# EasyEDA Pro project 包裹款-触摸屏控制板V1.eprj, board PCB
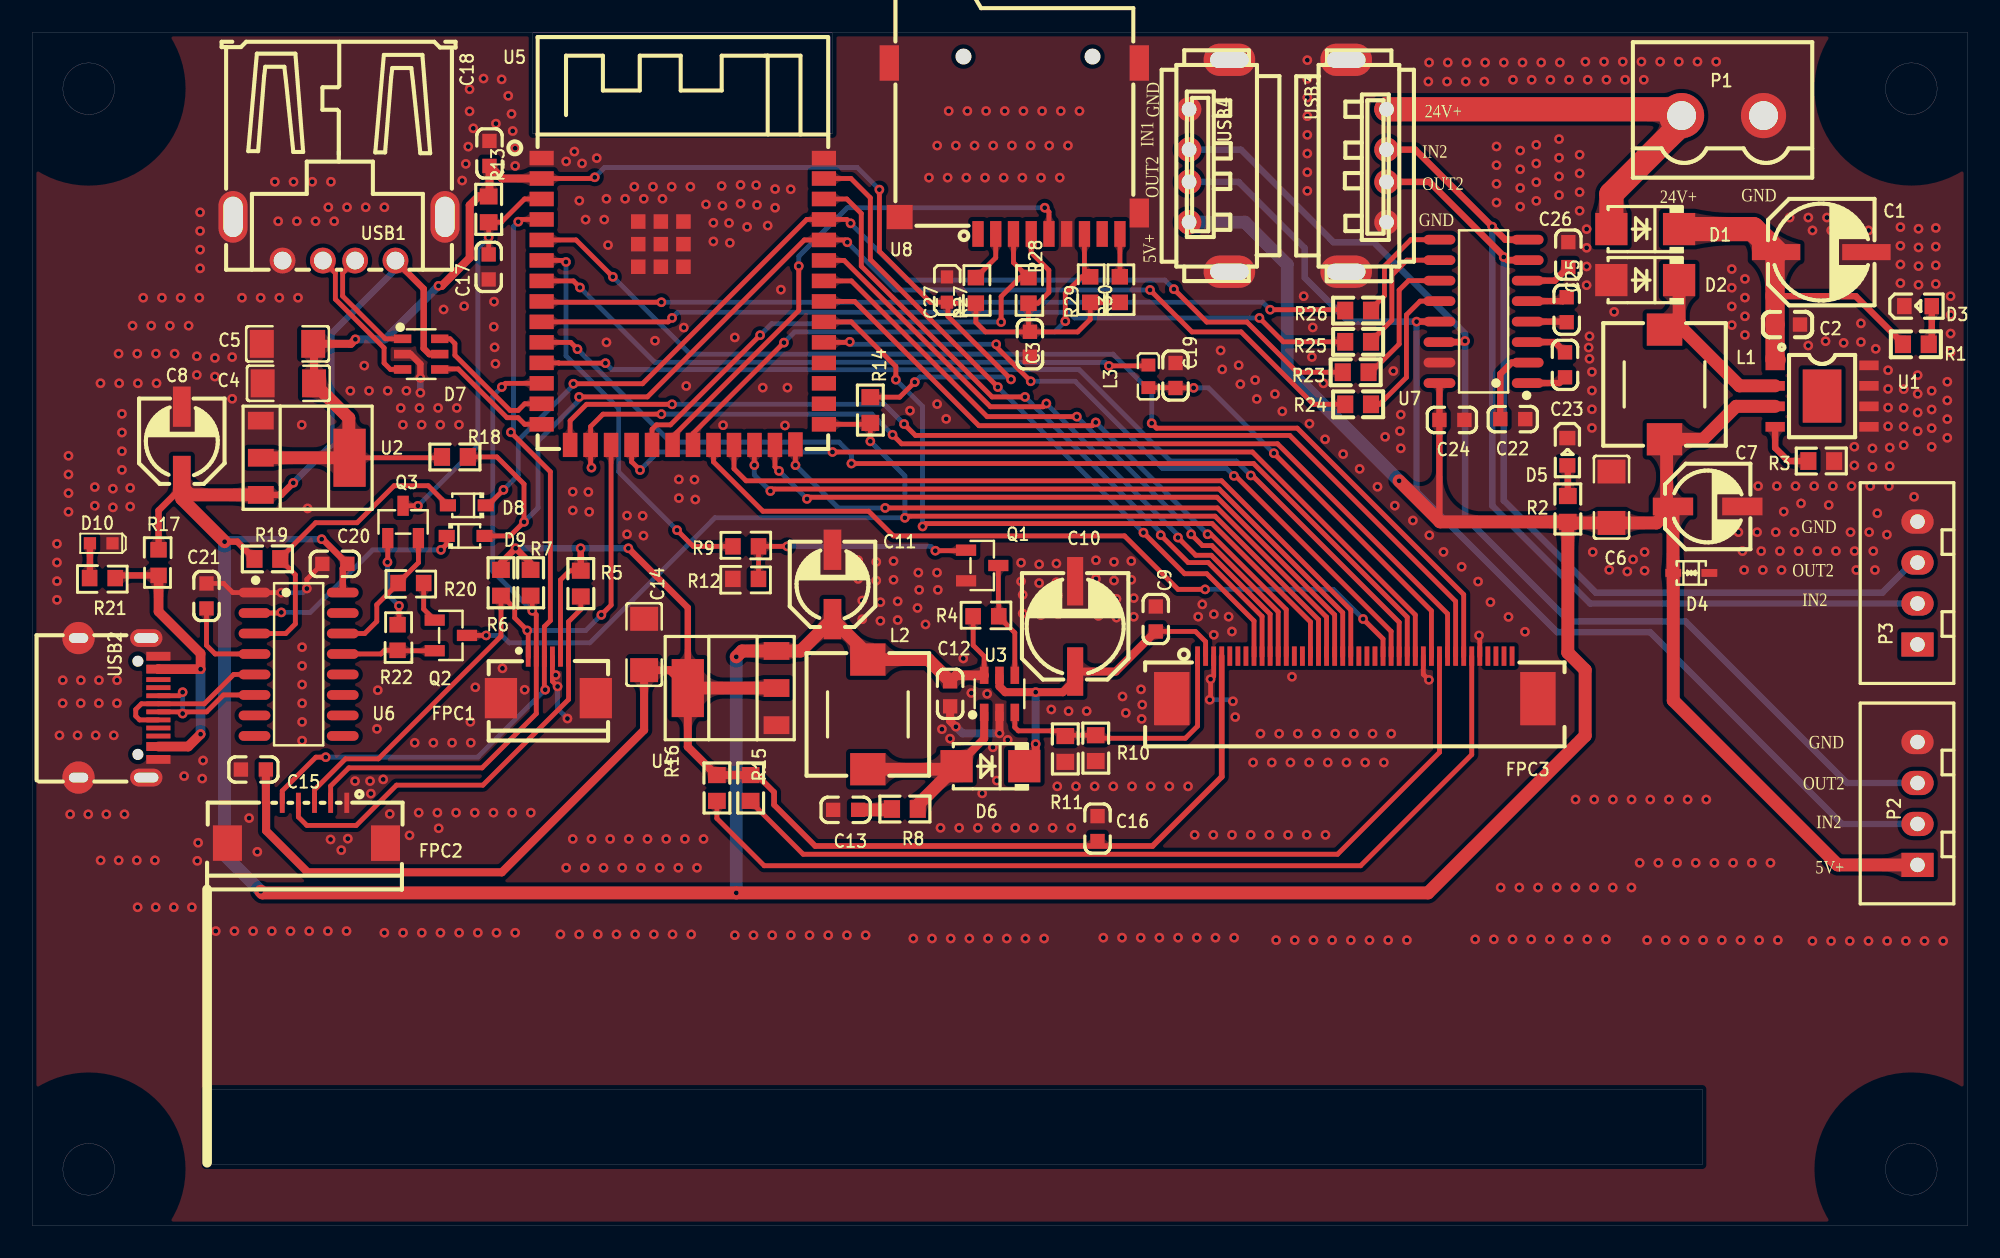
[diagram p1: board, top side]
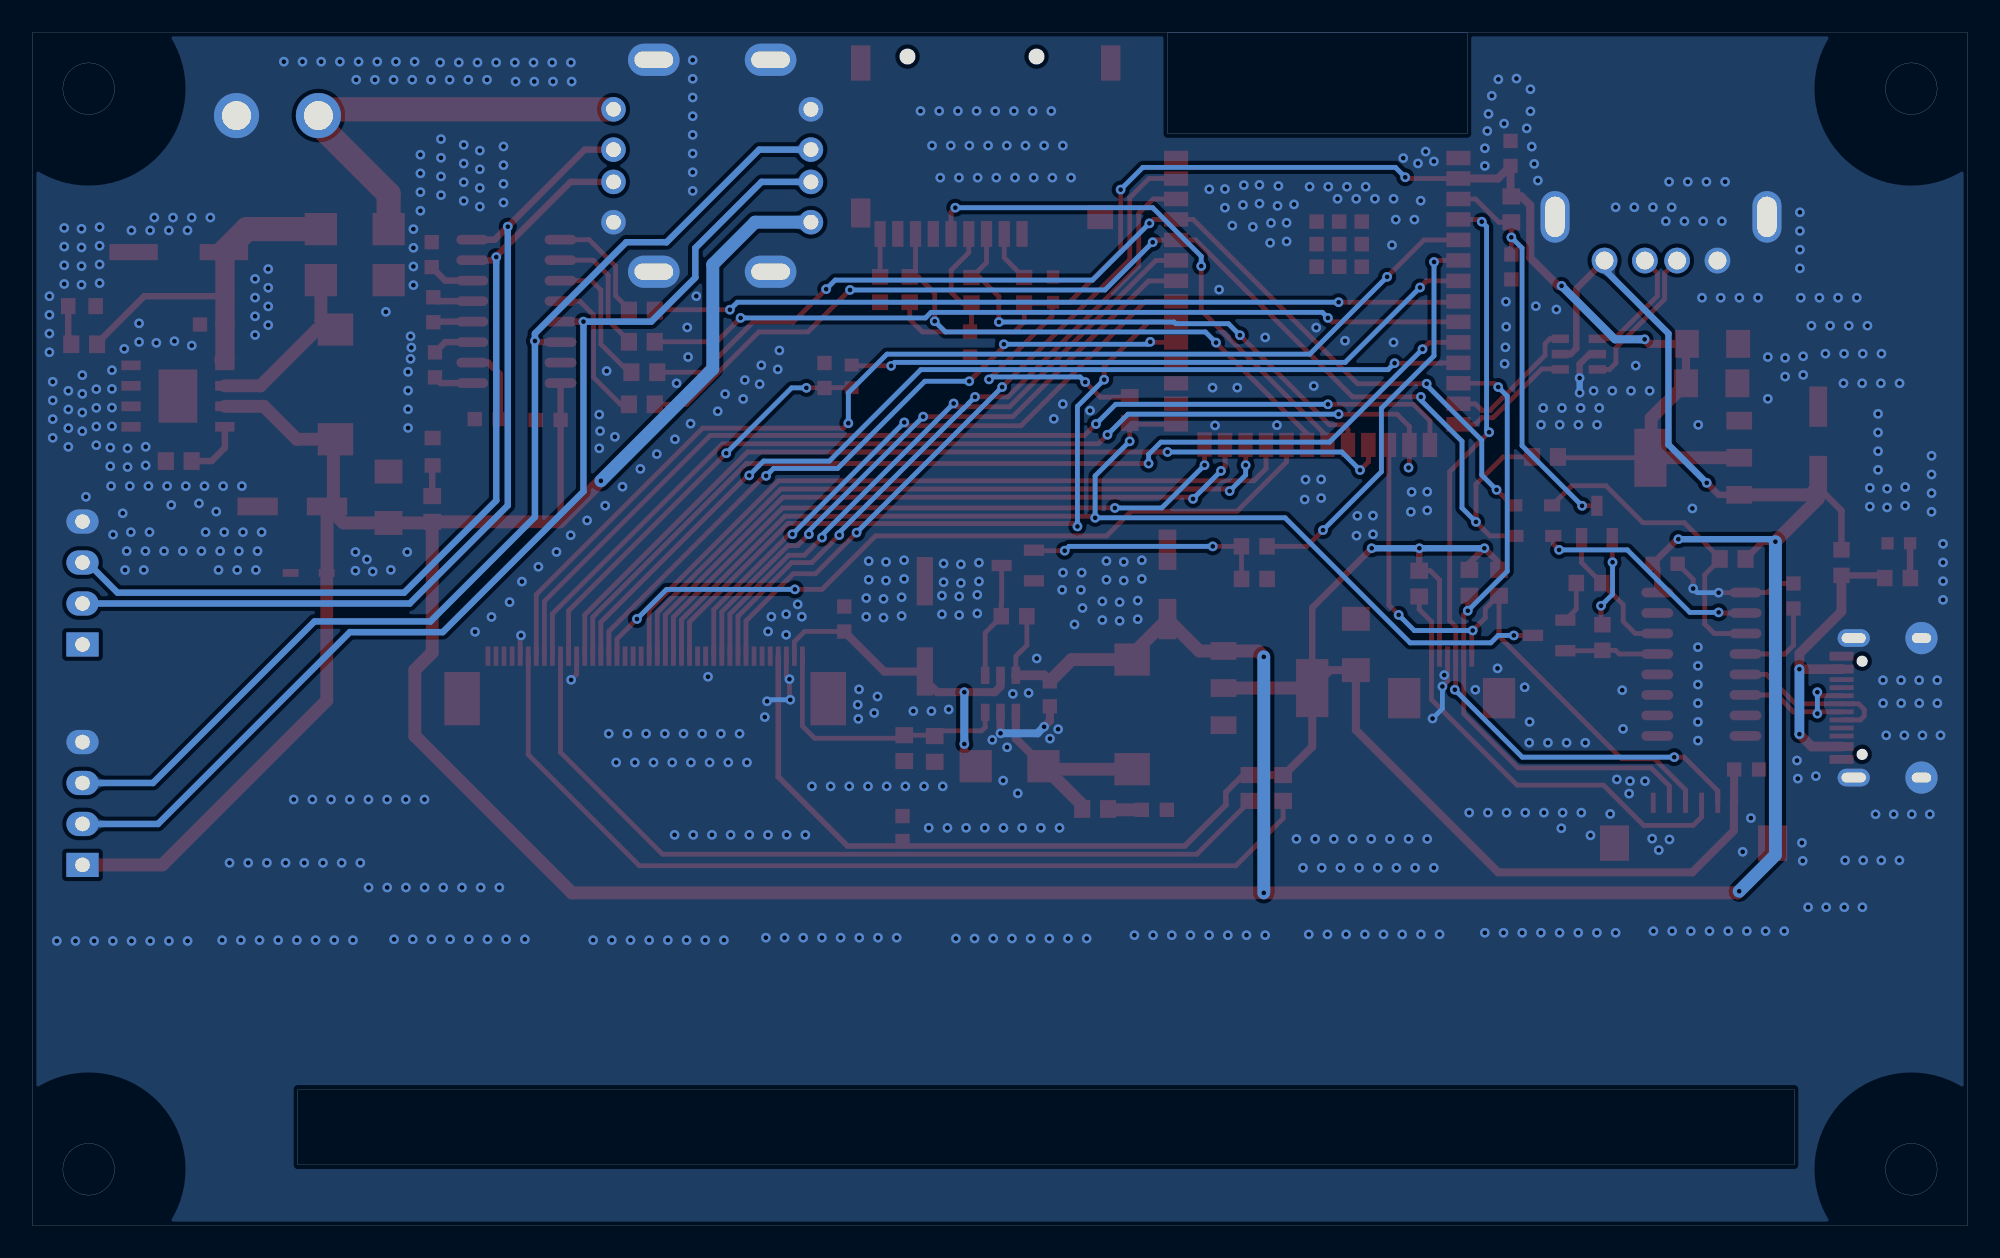
[diagram p2: board, bottom side, seen from below]

Outline 120 x 74 mm; copper layers: Top Layer, Bottom Layer. Coordinates in mm from the lower left corner of the outline.
Outline path: rectangle 0,74 120,0 ; circle c3.5,70.5 r1.6 ; circle c3.5,3.5 r1.6 ; rectangle 10.76,8.47 103.53,3.77 ; rectangle 31.04,73.98 49.6,67.71 ; circle c116.5,70.5 r1.6 ; circle c116.5,3.5 r1.6
Stack: Top Layer 0.035mm / Dielectric1 1.51mm FR4 er 4.5 / Bottom Layer 0.035mm

## Design rules (mm)
net USB_D+: DP1
net USB_D-: DP1
net D1-: DP2
net D1+: DP2
template: 用户自定义配置
spacing Default (default): track to track 0.152, other pairs 0 to 0.152
track width Default (default): min 0.254, default 0.254, max 25.4
differential pair differentialPair (default): width min 0.127, default 0.254, max 2.54; gap min 0.152, default 0.152
via Default (default): diameter min 0.25, default 0.61, max 100.025; hole min 0.2, default 0.305, max 59.995

## Placement (name value [footprint] x y rotation side)
C1  100uF/35V  [电解电容贴片6X6]  110.92 60.37 0 top
C2  104  [0603C]  108.83 55.88 180 top
C3  104  [0603C]  61.85 54.66 90 top
C4  4.7uF  [C1206]  15.88 52.23 0 top
C5  4.7uF  [C1206]  15.83 54.68 0 top
C6  10uF  [C1206]  97.91 45.17 90 top
C7  100uF/10V  [CAP-SMD_BD5.0-L5.3-W5.3-RD]  103.87 44.6 180 top
C8  100uF/10V  [CAP-SMD_BD5.0-L5.3-W5.3-RD]  9.27 48.64 270 top
C9  104  [0603C]  69.66 37.62 270 top
C10  100uF/35V  [电解电容贴片6X6]  64.66 37.16 90 top
C11  100uF/10V  [CAP-SMD_BD5.0-L5.3-W5.3-RD]  49.61 39.76 270 top
C12  104  [0603C]  56.91 32.98 90 top
C13  10pF  [0603C]  50.43 25.79 0 top
C14  4.7uF  [C1206]  37.94 36.04 270 top
C15  104  [0603C]  13.71 28.29 0 top
C16  104  [0603C]  66.05 24.63 270 top
C17  104  [0603C]  28.3 59.45 90 top
C18  104  [0603C]  28.35 66.49 270 top
C19  10pF  [0603C]  70.88 52.72 270 top
C20  104  [0603C]  18.76 41.04 180 top
C21  104  [0603C]  10.8 39.05 90 top
C22  104  [0603C]  91.79 50.01 180 top
C23  104  [0603C]  95.03 53.38 270 top
C24  104  [0603C]  88.02 49.96 180 top
C25  104  [0603C]  95.13 56.8 270 top
C26  104  [0603C]  95.23 60.21 90 top
C27  104  [11]  57.01 58.79 90 top
D1  SS56  [SMA]  100 61.8 180 top
D2  SS56  [SMA]  100 58.63 180 top
D3  绿光  [0603LED]  116.88 57 180 top
D4  PESD5V0L1BA-N  [SOD-323_L1.8-W1.3-LS2.5-BI]  102.86 40.48 180 top
D5  绿光  [0603LED]  95.16 48.03 90 top
D6  SS56  [SMA]  59.41 28.49 180 top
D7  USBLC6-2SC6  [SOT-23-6_L2.9-W1.6-P0.95-LS2.8-BL]  24.11 54.04 270 top
D8  1N4148WS  [SOD-323_L1.8-W1.3-LS2.5-RD]  26.94 44.67 180 top
D9  1N4148WS  [SOD-323_L1.8-W1.3-LS2.5-RD]  26.87 42.77 0 top
D10  LED红  [0603L]  4.27 42.31 0 top
FPC1  FPC-05F-6PH20(0.5)  [FPC-SMD_6P-P0.50_XUNPU_FPC-05F-6PH20]  32 34 0 top
FPC2  AFA01-S06FCC(1.0)  [FPC-SMD_6P-P1.00_AFA01-S06]  17 24.97 0 top
FPC3  AFC07-S40ECA-00  [FPC-SMD_P0.50-40P_LCS-SJ-H2.0]  82 34 180 top
L1  68uH  [IND-SMD_L7.0-W7.0_SMDRI74-330MT]  101.2 52.16 90 top
L2  10uH  [IND-SMD_L7.0-W7.0_SMDRI74-330MT]  51.81 31.71 270 top
L3  10uH  [L0603]  69.2 52.67 90 top
P1  KF2EDGVC-5.08-2P  [CONN-TH_P5.08_KF2EDGVC-5.08-2P]  104.8 68.83 180 top
P2  4P  [HDR1X4_CON]  116.88 22.37 90 top
P3  4P  [HDR1X4_CON]  116.88 36.04 90 top
Q1  SS8050  [SOT-23-3_L2.9-W1.3-P1.90-LS2.4-BR]  58.9 40.94 180 top
Q2  SS8050  [SOT-23-3_L2.9-W1.3-P1.90-LS2.4-BR]  25.95 36.6 180 top
Q3  SS8050  [SOT-23-3_L2.9-W1.3-P1.90-LS2.4-BR]  22.99 43.64 270 top
R1  47K  [0603R]  116.78 54.66 180 top
R2  10K  [0603R]  95.2 44.44 270 top
R3  10K  [0603R]  110.92 47.41 0 top
R4  10K  [10]  58.23 37.67 0 top
R5  10K  [0603R]  34.01 39.81 270 top
R6  10K  [0603R]  29.06 39.87 270 top
R7  10K  [0603R]  30.9 39.87 270 top
R8  10K  [0603R]  54.1 25.84 180 top
R9  1K  [10]  43.34 42.01 0 top
R10  10K  [0603R]  65.93 29.61 270 top
R11  10K  [0603R]  64.05 29.56 270 top
R12  10K  [10]  45.13 40.22 180 top
R13  10K  [0603R]  28.3 63.02 270 top
R14  10K  [0603R]  51.96 50.58 270 top
R15  10K  [0603R]  44.54 27.14 270 top
R16  10K  [0603R]  42.45 27.14 270 top
R17  0Ω  [10]  7.95 40.22 90 top
R18  10K  [0603R]  26.2 47.67 180 top
R19  10K  [0603R]  14.58 41.34 0 top
R20  10K  [10]  24.37 39.97 180 top
R21  10K  [10]  5.24 40.27 180 top
R22  10K  [10]  22.53 37.37 270 top
R23  100Ω  [0603R]  82.2 50.93 180 top
R24  100Ω  [0603R]  82.05 52.92 180 top
R25  100Ω  [0603R]  82.2 54.81 180 top
R26  100Ω  [0603R]  82.2 56.75 180 top
R27  10K  [10]  58.39 58.89 270 top
R28  10K  [10]  61.65 58.89 270 top
R29  10K  [10]  65.48 58.94 270 top
R30  10K  [10]  67.31 58.94 270 top
U1  XL1509-5.0E1//SXL1509-5.0E1  [ESOP-8_L4.9-W3.9-P1.27-LS6.0-BL-EP]  110.97 51.44 270 top
U2  1117-3.3  [SOT-223]  16.87 47.62 270 top
U3  RY3730  [SOT-23-6_L2.9-W1.6-P0.95-LS2.8-BL_3]  59.97 32.98 0 top
U4  1117-3.3  [SOT-223]  43.44 33.34 90 top
U5  ESPS3-32-WROOM-1-N16R8  [WIRELM-SMD_ESP32-S3-WROOM-2-N32R8V]  40.33 57.31 0 top
U6  CH340C  [SOIC-16_L9.9-W3.9-P1.27-LS6.0-BL]  16.51 34.82 270 top
U7  SP3232EEN-L/TR  [SOIC-16_L9.9-W3.9-P1.27-LS6.0-BL]  89.98 56.69 90 top
U8  自弹TF卡座TFAA  [SIM-SMD_C9900015645]  60.89 66.79 180 top
USB1  U-USBAR04P-F002  [USB-A-TH_USB-302-T]  19.02 61.2 180 top
USB2  TYPE-C 16PIN  [USB-C-SMD_TYPE-C-6PIN+]  5.24 32.11 270 top
USB3  U-USBAS04P-F001  [USB-A-TH_USB-M-22]  82.71 65.72 270 top
USB4  U-USBAS04P-F001  [USB-A-TH_USB-M-22]  72.97 65.72 90 top

## Footprints (pads in the part's own frame, mm; a bottom-side part is the same pattern mirrored in y, then rotated)
10
  rect 0.965x1.016 smd: 1(0.101,0.117) 2(1.688,0.117)
11
  rect 0.813x0.762 smd: 1(0.043,0.296) 2(-1.524,0.301)
0603C
  rect 0.889x0.889 smd: 1(-0.774,0) 2(0.774,0)
0603L
  rect 0.762x0.762 smd: 1(-0.699,0) 2(0.699,0)
0603LED
  rect 0.9x1 smd: 1(-0.884,-0.017) 2(0.816,-0.017)
0603R
  rect 1x1.1 smd: 1(-0.8,0) 2(0.8,0)
C1206
  rect 1.485x1.728 smd: 1(-1.593,0) 2(1.593,0)
CAP-SMD_BD5.0-L5.3-W5.3-RD
  rect 2.5x1.1 smd: 1(2.15,0) 2(-2.15,0)
CONN-TH_P5.08_KF2EDGVC-5.08-2P
  round 2.8 hole 1.8: 1(-2.54,0) 2(2.54,0)
ESOP-8_L4.9-W3.9-P1.27-LS6.0-BL-EP
  rect 0.6x1.2 smd: 1(-1.905,-2.909) 2(-0.635,-2.909) 3(0.635,-2.909) 4(1.905,-2.909) 5(1.905,2.909) 6(0.635,2.909) 7(-0.635,2.909) 8(-1.905,2.909)
  rect 3.3x2.4 smd: 9(0,0)
FPC-SMD_6P-P0.50_XUNPU_FPC-05F-6PH20
  rect 0.3x1.25 smd: 1(-1.25,1.288) 2(-0.75,1.288) 3(-0.25,1.288) 4(0.25,1.288) 5(0.75,1.288) 6(1.25,1.288)
  rect 2x2.5 smd: 7(2.94,-1.288) 8(-2.94,-1.288)
FPC-SMD_6P-P1.00_AFA01-S06
  rect 0.3x1.25 smd: 1(2.5,1.25) 2(1.5,1.25) 3(0.5,1.25) 4(-0.5,1.25) 5(-1.5,1.25) 6(-2.5,1.25)
  rect 1.8x2.2 smd: 7(4.9,-1.25) 8(-4.9,-1.248)
FPC-SMD_P0.50-40P_LCS-SJ-H2.0
  rect 0.3x1.2 smd: 1(9.751,-1.318) 2(9.252,-1.318) 3(8.753,-1.318) 4(8.252,-1.318) 5(7.752,-1.318) 6(7.252,-1.318) 7(6.752,-1.318) 8(6.251,-1.318) 9(5.753,-1.318) 10(5.253,-1.318) 11(4.753,-1.318) 12(4.252,-1.318) 13(3.752,-1.318) 14(3.251,-1.318) 15(2.752,-1.318) 16(2.253,-1.318) 17(1.752,-1.318) 18(1.252,-1.318) 19(0.752,-1.318) 20(0.252,-1.318) 21(-0.249,-1.318) 22(-0.748,-1.318) 23(-1.247,-1.318) 24(-1.748,-1.318) 25(-2.248,-1.318) 26(-2.748,-1.318) 27(-3.248,-1.318) 28(-3.749,-1.318) 29(-4.247,-1.318) 30(-4.747,-1.318) 31(-5.247,-1.318) 32(-5.748,-1.318) 33(-6.248,-1.318) 34(-6.749,-1.318) 35(-7.248,-1.318) 36(-7.747,-1.318) 37(-8.248,-1.318) 38(-8.748,-1.318) 39(-9.248,-1.318) 40(-9.748,-1.318)
  rect 2.2x3.3 smd: 41(11.35,1.318) 42(-11.35,1.318)
HDR1X4_CON
  rect 1.5x2 hole 0.9: 1(0,0)
  oval 1.5x2 hole 0.9: 2(2.54,0) 3(5.08,0) 4(7.62,0)
IND-SMD_L7.0-W7.0_SMDRI74-330MT
  rect 2x2.2 smd: 1(-3.4,0) 2(3.4,0)
L0603
  rect 0.8x0.864 smd: 1(-0.7,0) 2(0.7,0)
SIM-SMD_C9900015645
  rect 0.7x1.6 smd: 1(2.25,5.3) 2(1.15,5.3) 3(0.05,5.3) 4(-1.05,5.3) 5(-2.15,5.3) 6(-3.25,5.3) 7(-4.35,5.3) 8(-5.45,5.3) 9(-6.55,5.3)
  rect 1.2x1.8 smd: 10(-7.75,4)
  rect 1.6x1.5 smd: 11(7.1,4.25)
  rect 1.2x2.2 smd: 12(-7.75,-5.3) 13(7.75,-5.3)
SMA
  rect 2x2 smd: 1(2.1,0) 2(-2.1,0)
SOD-323_L1.8-W1.3-LS2.5-BI
  rect 0.986x0.49 smd: 1(-1.117,0) 2(1.117,0)
SOD-323_L1.8-W1.3-LS2.5-RD
  rect 1x0.75 smd: 1(-1.173,0) 2(1.173,0)
SOIC-16_L9.9-W3.9-P1.27-LS6.0-BL
  oval 0.602x1.971 smd: 1(-4.445,-2.736) 2(-3.175,-2.736) 3(-1.905,-2.736) 4(-0.635,-2.736) 5(0.635,-2.736) 6(1.905,-2.736) 7(3.175,-2.736) 8(4.445,-2.736) 9(4.445,2.736) 10(3.175,2.736) 11(1.905,2.736) 12(0.635,2.736) 13(-0.635,2.736) 14(-1.905,2.736) 15(-3.175,2.736) 16(-4.445,2.736)
SOT-23-3_L2.9-W1.3-P1.90-LS2.4-BR
  rect 1.25x0.7 smd: 1(1,-0.95) 2(1,0.95) 3(-1,0)
SOT-23-6_L2.9-W1.6-P0.95-LS2.8-BL
  rect 0.532x1.072 smd: 1(-0.95,-1.149) 2(0,-1.149) 3(0.95,-1.149) 4(0.95,1.149) 5(0,1.149) 6(-0.95,1.149)
SOT-23-6_L2.9-W1.6-P0.95-LS2.8-BL_3
  rect 0.532x1.072 smd: 1(-0.95,-1.149) 2(0,-1.149) 3(0.95,-1.149) 4(0.95,1.149) 5(0,1.149) 6(-0.95,1.149)
SOT-223
  rect 1.1x1.6 smd: 1(-2.3,-2.7) 2(0,-2.7) 3(2.3,-2.7)
  rect 3.6x2 smd: 4(0,2.8)
USB-A-TH_USB-302-T
  round 1.6 hole 1.1: 1(-3.5,1.355) 2(-1,1.355) 3(1,1.355) 4(3.5,1.355)
  oval 1.8x3.2 hole 1.2x2.5: 5(-6.57,-1.355) 6(6.57,-1.355)
USB-A-TH_USB-M-22
  oval 2x3.2 hole 1x2.4: 0(-6.57,-1.25) 0(6.57,-1.25)
  round 1.524 hole 0.914: 1(-3.5,1.25) 2(-1.001,1.25) 3(1.001,1.25) 4(3.5,1.25)
USB-C-SMD_TYPE-C-6PIN+
  rect 0.55x1.5 smd: 1(-3.2,2.575) 2(-2.4,2.575) 11(2.4,2.575) 12(3.2,2.575)
  rect 0.3x1.5 smd: 3(-1.75,2.575) 4(-1.25,2.575) 5(-0.75,2.575) 6(-0.25,2.575) 7(0.25,2.575) 8(0.75,2.575) 9(1.25,2.575) 10(1.75,2.575)
  oval 1.1x2 hole 0.6x1.5: 13(-4.325,1.825) 14(4.325,1.825)
  oval 2x2 hole 0.6x1.2: 13(-4.325,-2.375) 14(4.325,-2.375)
WIRELM-SMD_ESP32-S3-WROOM-2-N32R8V
  rect 1.5x0.9 smd: 1(-8.75,8.895) 2(-8.75,7.625) 3(-8.75,6.355) 4(-8.75,5.085) 5(-8.75,3.815) 6(-8.75,2.545) 7(-8.75,1.275) 8(-8.75,0.005) 9(-8.75,-1.265) 10(-8.75,-2.535) 11(-8.75,-3.805) 12(-8.75,-5.075) 13(-8.75,-6.345) 14(-8.75,-7.615) 27(8.75,-7.615) 28(8.75,-6.345) 29(8.75,-5.075) 30(8.75,-3.805) 31(8.75,-2.535) 32(8.75,-1.265) 33(8.75,0.005) 34(8.75,1.275) 35(8.75,2.545) 36(8.75,3.815) 37(8.75,5.085) 38(8.75,6.355) 39(8.75,7.625) 40(8.75,8.895)
  rect 0.9x1.5 smd: 15(-6.985,-8.895) 16(-5.715,-8.895) 17(-4.445,-8.895) 18(-3.175,-8.895) 19(-1.905,-8.895) 20(-0.635,-8.895) 21(0.635,-8.895) 22(1.905,-8.895) 23(3.175,-8.895) 24(4.445,-8.895) 25(5.715,-8.895) 26(6.985,-8.865)
  rect 0.9x0.9 smd: 41(-2.76,4.955) 41(-2.76,3.555) 41(-2.76,2.155) 41(-1.36,4.955) 41(-1.36,3.555) 41(-1.36,2.155) 41(0.04,4.955) 41(0.04,3.555) 41(0.04,2.155)
电解电容贴片6X6
  rect 3x1 smd: 1(-2.8,0) 2(2.8,0)

## Nets
As in the schematic, except:
3V3: C3.2 C4.2 C5.2 C18.2 C27.2 R13.1 R14.1 R18.2 R27.2 R28.2 R29.2 R30.2 U2.2 U2.4 U5.2 U8.4
GND: C1.2 C2.1 C3.1 C4.1 C5.1 C6.2 C7.2 C8.2 C9.1 C10.2 C11.2 C12.1 C13.1 C14.1 C15.1 C16.1 C17.1 C18.1 C19.1 C20.2 C21.2 C22.1 C24.1 C26.2 C27.1 D2.1 D3.2 D4.1 D5.2 D7.2 D10.2 FPC1.4 FPC1.7 FPC1.8 FPC2.1 FPC2.7 FPC2.8 FPC3.3 FPC3.29 FPC3.36 FPC3.41 FPC3.42 P1.1 P2.4 P3.4 Q1.2 R3.2 R10.2 R11.2 R12.2 U1.5 U1.6 U1.7 U1.8 U2.1 U3.2 U4.1 U5.1 U5.40 U5.41 U6.1 U7.15 U8.6 U8.10 U8.11 U8.12 U8.13 USB1.4 USB1.5 USB1.6 USB2.1 USB2.12 USB2.13 USB2.14 USB3.0 USB3.4 USB4.0 USB4.4

Pads without a net: FPC3 5 6 7 13 14 21 22 23 37 38 39 40; P3 1; U1 9; U5 28 29 30; U6 7 8 9 10 11 12 15; U8 1 8; USB2 3 9

## Via types
v1: diameter 0.6, hole 0.3, Top Layer to Bottom Layer, 789 vias

## Routing (per net, layer and track width the routed paths; a pad name or vN(x,y) marks a point on that pad's centre or on a via; arc(x,y) is an arc through that point)
3V3: length 109
  Top Layer w0.3: U5.2 34.8,64.93 v1(34.88,65.01) ; 61.72,55.42 64.81,55.42 65.59,56.2 65.59,57.25 67.43,57.25 ; 61.72,55.42 61.77,55.46 R28.2 62.36,57.2 63.03,57.87 63.03,59.25 61.94,60.34 U8.4 ; 61.72,55.42 59.1,55.42 58.5,56.02 R27.2 56.77,57.2 ; U2.4 25.35,47.62 R18.2 ; v1(54.71,52.31) 53.78,51.38 R14.1 ; v1(52.52,64.24) 52.52,60.42 55.68,57.26 C27.2 56.77,57.2 ; 56.77,57.2 56.77,56.39 v1(60.68,52.48)
  Top Layer w0.5: v1(20.03,54.96) 19.75,54.68 C5.2 17.47,54.63 C4.2 ; 19.63,47.66 U2.4 ; v1(25.19,58.28) 25.39,58.28 27.12,60.01 27.12,63.27 27.67,63.82 R13.1 28.35,63.87 28.35,65.71 29.13,64.93 U5.2
  Top Layer w0.8: C4.2 19.63,50.08 19.63,47.66 19.58,47.62 U2.2
  Bottom Layer w0.3: v1(60.68,52.48) 60.53,52.63 55.03,52.63 v1(54.71,52.31) ; v1(34.88,65.01) 35.49,65.62 51.14,65.62 v1(52.52,64.24)
  Bottom Layer w0.5: v1(25.19,58.28) 21.87,54.96 v1(20.03,54.96)
3V3_CM: length 121.6
  Top Layer w0.3: R5.1 33.32,40.61 32.75,40.04 FPC1.5
  Top Layer w0.35: FPC3.4 73.75,27.84 69.45,23.55 48.54,23.55 45.99,26.1 45.99,26.88 45.03,27.84 44.54,27.84
  Top Layer w0.4: v1(36.96,42.01) 40.64,38.32 U4.4 ; R5.1 34.01,42 v1(34,42.01) ; R6.1 29.06,41.1 v1(29.97,42.01) 30.9,41.08 R7.1
  Top Layer w0.5: C15.2 14.48,26.24 FPC2.6 14.5,24.49 17.08,21.91 29.11,21.91 37.94,30.74 C14.2 39.53,34.45 U4.4 40.64,29.7 42.4,27.94 R16.1 44.44,27.94 44.54,27.84
  Top Layer w0.8: U4.2 U4.4
  Bottom Layer w0.4: v1(29.97,42.01) v1(34,42.01) v1(36.96,42.01)
5V_SHAOLU: length 19.2
  Top Layer w0.4: R17.1 5.31,40.32 R21.1
  Top Layer w0.6: R17.1 7.83,38.08 10.44,35.48 v1(10.44,34.51) 7.82,34.51 USB2.2 ; v1(10.44,30.48) 9.67,29.71 USB2.11
  Bottom Layer w0.6: v1(10.44,30.48) v1(10.44,34.51)
5V_VCC: length 306.3
  Top Layer w0.3: U3.6 59.02,35.31 58.33,35.99 R4.1
  Top Layer w0.4: 9.27,45.79 7.83,44.34 R17.2 ; v1(16.18,46.06) 15.44,45.32 U2.3 ; U7.16 87.25,49.97 C24.2 87.24,43.64 ; v1(11.92,42.42) 12.71,42.42 13.78,41.34 ; D7.5 24.62,54.04 24.27,54.4 24.27,58.1 22.52,59.84 ; 19.25,39.26 19.25,40.76 C20.1 18,42.57 v1(17.94,42.57)
  Top Layer w0.6: C12.2 57.28,34.13 U3.6
  Top Layer w0.8: C8.1 9.27,45.85 ; 9.27,45.85 9.81,45.32 U2.3 ; 9.27,45.85 9.27,45.07 v1(11.92,42.42) ; 101.33,44.66 101.33,48.63 L1.1 103.6,48.76 105.64,50.81 U1.3 ; v1(84.74,46.19) 87.29,43.64 R2.2 ; v1(14.17,20.74) 14.27,20.64 v1(43.65,20.64) 86.54,20.64 96.28,30.38 96.28,34.46 95.2,35.54 95.2,43.58 ; 95.27,43.58 C6.1 100.7,43.58 C7.1 101.72,40.49 D4.2 101.74,32.57 111.94,22.37 P2.1 ; C12.2 55.56,35.11 L2.1 51.81,35.42 49.61,37.61 47.64,35.64 44.01,35.64 v1(43.65,35.28)
  Bottom Layer w0.4: 22.52,59.84 22.52,59.28 18.55,55.32 18.55,48.43 v1(16.18,46.06) ; v1(17.94,42.57) 12.08,42.57 v1(11.92,42.42)
  Bottom Layer w0.8: v1(11.92,42.42) 11.92,22.98 v1(14.17,20.74) ; USB4.1 75.19,62.22 77.81,59.6 77.81,53.12 v1(84.74,46.19) ; v1(43.65,20.64) v1(43.65,35.28)
24V_D1: length 22.5
  Top Layer w0.4: 108.05,57.63 113.05,57.63 115.98,54.71 R1.2
  Top Layer w1.2: C1.1 108.05,60.3 C2.2 108.05,53.75 108.11,53.69
  Top Layer w1.5: D1.2 106.69,61.8 C1.1
GND: length 28.6
  Top Layer w0.3: v1(32.57,33.44) 32.25,33.76 FPC1.4 ; v1(17.02,39.51) 17.02,40.08 C20.2 ; FPC3.3 73.25,34.08 v1(73.05,33.89) 73.05,32.66 v1(73,32.61) ; v1(86.59,33.85) 86.25,34.19 FPC3.29 ; v1(89.7,36.6) 89.75,36.56 FPC3.36 ; v1(15.44,39.25) 13.79,39.25 U6.1 12.43,39.26 11.86,39.82 C21.2
  Top Layer w0.4: 22.96,54.04 23.45,54.04 24.06,53.43 v1(24.06,52.56)
  Top Layer w0.5: C12.1 56.91,31.3 v1(57.26,30.94) ; U3.2 v1(59.97,30.53)
  Bottom Layer w0.3: v1(15.44,39.25) 16.77,39.25 v1(17.02,39.51) ; v1(32.57,33.44) 32.57,32.06 v1(33.18,31.45) ; v1(73,32.61) 74.35,32.61 v1(74.44,32.52)
  Bottom Layer w0.4: v1(24.06,52.56) v1(24.06,51.65)
  Bottom Layer w0.5: v1(59.97,30.53) 57.67,30.53 v1(57.26,30.94)
  vias: v1(1.53,42.28) v1(1.53,41.13) v1(1.53,39.97) v1(1.53,38.81) v1(1.69,30.41) v1(1.89,33.82) v1(1.88,32.4) v1(2.25,47.74) v1(2.25,46.58) v1(2.25,45.42) v1(2.25,44.27) v1(2.35,25.51) v1(2.81,30.41) v1(3.01,33.82) v1(3.01,32.4) v1(3.47,25.51) v1(3.88,45.8) v1(3.88,44.64) v1(3.93,30.41) v1(4.13,33.82) v1(4.13,32.4) v1(4.23,52.24) v1(4.24,22.66) v1(4.59,25.51) v1(5,45.7) v1(5,44.54) v1(5.05,30.41) v1(5.26,33.82) v1(5.25,32.4) v1(5.35,54.07) v1(5.36,22.66) v1(5.39,52.24) v1(5.56,50.34) v1(5.56,49.18) v1(5.56,48.02) v1(5.56,46.87) v1(5.72,25.51) v1(6.07,45.75) v1(6.07,44.59) v1(6.22,55.81) v1(6.48,22.66) v1(6.51,54.07) v1(6.55,52.24) v1(6.53,19.75) v1(6.88,57.54) v1(7.38,55.81) v1(7.67,54.07) v1(7.6,22.66) v1(7.65,19.75) v1(7.7,52.24) v1(8.04,57.54) v1(8.54,55.81) v1(8.78,19.75) v1(8.83,54.07) v1(9.2,57.54) v1(9.42,27.88) v1(9.69,55.81) v1(9.9,19.75) v1(10.2,53.91) v1(10.2,52.75) v1(10.23,22.63) v1(10.36,57.54) v1(10.28,23.75) v1(10.41,62.84) v1(10.41,61.68) v1(10.41,60.52) v1(10.41,59.36) v1(10.54,27.73) v1(10.59,28.85) v1(11.32,53.81) v1(11.32,52.65) v1(11.38,18.27) v1(12.39,53.86) v1(12.39,51.27) v1(12.54,18.27) v1(13,57.54) v1(13.44,25.28) v1(13.69,18.27) v1(13.95,23.19) v1(14.16,57.54) v1(14.85,18.27) v1(15.04,64.73) v1(15.25,62.28) v1(15.32,57.54) v1(16.01,18.27) v1(16.2,64.73) v1(16.4,62.28) v1(16.48,57.54) v1(16.71,49.66) v1(16.73,35.87) v1(16.73,34.71) v1(16.73,33.56) v1(16.73,32.4) v1(16.73,31.24) v1(16.73,30.08) v1(17.07,44.48) v1(17.17,18.27) v1(17.36,64.73) v1(17.56,62.28) v1(18.36,63.15) v1(18.33,18.27) v1(18.52,64.73) v1(18.49,23.95) v1(18.72,62.28) v1(19.16,23.29) v1(19.52,63.15) v1(19.56,24) v1(19.49,18.27) v1(19.72,51.77) v1(20.01,27.57) v1(20.67,63.15) v1(20.58,53.33) v1(20.88,51.77) v1(20.94,27.57) v1(20.99,26.79) v1(21.37,30.81) v1(21.42,33.21) v1(21.76,27.67) v1(21.83,63.15) v1(21.83,18.17) v1(22.04,51.77) v1(22.17,25.53) v1(22.84,50.71) v1(22.98,49.66) v1(22.99,18.17) v1(23.2,51.77) v1(23.39,24.21) v1(23.71,29.95) v1(23.96,25.61) v1(24,50.71) v1(24.14,49.66) v1(24.15,18.17) v1(24.87,29.95) v1(25.16,50.71) v1(25.12,25.61) v1(25.2,24.64) v1(25.3,49.66) v1(25.31,18.17) v1(25.5,56.81) v1(26.03,29.95) v1(26.28,25.61) v1(26.32,50.71) v1(26.46,49.66) v1(26.47,18.17) v1(26.65,64.81) v1(26.78,57.02) v1(26.88,65.84) v1(27.03,66.91) v1(27.11,70.47) v1(27.11,69.1) v1(27.16,31.24) v1(27.19,29.95) v1(27.34,68.04) v1(27.47,33.39) v1(27.44,25.61) v1(27.62,18.17) v1(27.98,71.13) v1(28.63,57.3) v1(28.61,55.74) v1(28.66,54.47) v1(28.59,25.61) v1(28.75,68.34) v1(28.72,53.45) v1(28.78,18.17) v1(29.1,71.08) v1(29.15,34.56) v1(29.51,70.06) v1(29.71,68.94) v1(29.75,25.61) v1(29.79,67.88) v1(29.94,66.81) v1(29.94,65.71) v1(29.94,18.17) v1(30.53,33.23) v1(30.91,25.61) v1(32.46,34.14) v1(32.75,18.07) v1(33.1,65.99) v1(33.1,22.2) v1(33.51,45.51) v1(33.51,44.35) v1(33.51,23.98) v1(33.61,66.6) v1(33.92,63.56) v1(33.9,18.07) v1(34.09,65.87) v1(34.26,22.2) v1(34.31,62.38) v1(34.48,45.5) v1(34.53,44.27) v1(34.67,23.98) v1(35,66.2) v1(35.06,18.07) v1(35.46,62.38) v1(35.42,22.2) v1(35.6,63.68) v1(35.6,54.77) v1(35.7,60.8) v1(35.83,23.98) v1(36.22,18.07) v1(36.58,22.2) v1(36.76,63.68) v1(36.88,44.03) v1(36.88,42.87) v1(36.99,23.98) v1(37.33,64.42) v1(37.38,18.07) v1(37.74,22.2) v1(37.84,44.02) v1(37.91,63.68) v1(37.9,42.79) v1(38.14,23.98) v1(38.49,64.42) v1(38.54,18.07) v1(38.61,54.87) v1(38.9,22.2) v1(39.07,63.68) v1(39.3,23.98) v1(39.65,64.42) v1(39.7,18.07) v1(40.05,22.2) v1(40.09,46.28) v1(40.09,45.12) v1(40.39,55.69) v1(40.46,23.98) v1(40.55,52.07) v1(40.8,64.42) v1(40.86,18.07) v1(41.06,46.26) v1(41.11,45.03) v1(41.21,22.2) v1(41.62,23.98) v1(41.77,63.33) v1(42.23,62.19) v1(42.23,61.03) v1(42.74,64.47) v1(42.79,63.24) v1(42.83,49.64) v1(43.2,62.17) v1(43.25,60.94) v1(43.56,55.08) v1(43.56,18.01) v1(43.91,64.53) v1(43.91,63.38) v1(44.32,61.93) v1(44.72,18.01) v1(44.88,64.52) v1(44.93,63.29) v1(45.29,51.97) v1(45.6,62.01) v1(45.88,18.01) v1(46.06,64.28) v1(46.06,63.12) v1(46.42,58.04) v1(46.67,49.62) v1(46.82,51.97) v1(47.02,64.27) v1(47.03,18.01) v1(48.19,18.01) v1(49.35,18.01) v1(50.51,18.01) v1(51.21,41.26) v1(51.21,40.11) v1(51.46,38.76) v1(51.46,37.61) v1(51.67,18.01) v1(52.33,41.16) v1(52.33,40) v1(52.58,38.66) v1(52.58,37.5) v1(53.4,41.21) v1(53.4,40.05) v1(53.65,38.71) v1(53.65,37.56) v1(54.42,50.54) v1(54.63,17.81) v1(54.94,40.5) v1(54.89,38.3) v1(54.99,39.43) v1(55.38,37.28) v1(55.59,64.99) v1(55.78,17.81) v1(56.1,66.97) v1(56.1,50.95) v1(56.09,40.5) v1(56.15,39.43) v1(56.31,24.67) v1(56.4,30.79) v1(56.66,50.03) v1(56.75,64.99) v1(56.82,69.12) v1(56.9,30.2) v1(56.94,17.81) v1(57.26,66.97) v1(57.47,24.67) v1(57.72,35.17) v1(57.98,69.12) v1(57.91,64.99) v1(58.1,17.81) v1(58.22,33.03) v1(58.42,66.97) v1(58.63,24.67) v1(58.9,26.81) v1(59.07,64.99) v1(59.14,69.12) v1(59.2,32.98) v1(59.26,17.81) v1(59.58,66.97) v1(59.56,29.67) v1(59.8,27.6) v1(59.79,24.67) v1(60.23,64.99) v1(60.29,69.12) v1(60.48,30.12) v1(60.42,17.81) v1(60.74,66.97) v1(60.94,24.67) v1(61.3,41.11) v1(61.3,39.95) v1(61.45,69.12) v1(61.39,64.99) v1(61.41,39.12) v1(61.41,37.96) v1(61.58,17.81) v1(61.9,66.97) v1(62.1,24.67) v1(62.43,41.01) v1(62.43,39.85) v1(62.55,64.99) v1(62.53,39.02) v1(62.53,37.86) v1(62.61,69.12) v1(62.73,17.81) v1(63.05,66.97) v1(63.18,32.01) v1(63.26,24.67) v1(63.5,41.06) v1(63.5,39.9) v1(63.55,27.25) v1(63.6,39.07) v1(63.6,37.91) v1(63.77,69.12) v1(63.7,64.99) v1(64.21,66.97) v1(64.25,31.91) v1(64.42,24.67) v1(64.71,27.25) v1(64.93,69.12) v1(65.37,31.91) v1(65.87,27.25) v1(65.95,41.26) v1(65.95,40.11) v1(66.1,38.97) v1(66.1,37.81) v1(66.41,17.86) v1(67.07,41.16) v1(67.07,40) v1(67.03,27.25) v1(67.22,38.87) v1(67.22,37.71) v1(67.56,17.86) v1(67.6,32.82) v1(67.8,31.8) v1(68.14,41.21) v1(68.14,40.05) v1(68.18,27.25) v1(68.29,38.92) v1(68.29,37.76) v1(68.74,33.26) v1(68.72,17.86) v1(68.82,32.31) v1(68.78,31.43) v1(69.34,27.25) v1(69.88,17.86) v1(70.5,27.25) v1(71.04,17.86) v1(71.66,27.25) v1(72.07,24.24) v1(72.2,17.86) v1(72.29,37.76) v1(72.54,38.53) v1(73.26,37.92) v1(73.26,36.64) v1(73.23,24.24) v1(73.36,17.86) v1(73.68,54.27) v1(73.78,53.1) v1(74.17,37.76) v1(74.38,36.85) v1(74.38,24.24) v1(74.52,17.86) v1(74.58,31.54) v1(74.8,53.35) v1(74.9,52.18) v1(75.54,24.24) v1(75.69,28.72) v1(75.82,52.44) v1(75.92,51.26) v1(76.15,30.51) v1(76.7,24.24) v1(76.85,28.72) v1(77.04,51.57) v1(77.12,17.71) v1(77.31,30.51) v1(77.5,50.5) v1(77.86,24.24) v1(78.01,28.72) v1(78.1,34.04) v1(78.27,17.71) v1(78.46,30.51) v1(78.83,57.64) v1(79.05,72.27) v1(79.05,71.11) v1(79.05,69.96) v1(79.05,68.8) v1(79.05,67.64) v1(79.05,66.48) v1(79.05,65.32) v1(79.05,64.16) v1(79.02,24.24) v1(79.16,28.72) v1(79.18,49.73) v1(79.34,53.86) v1(79.39,55.7) v1(79.43,17.71) v1(79.62,30.51) v1(80.05,52.23) v1(80.15,48.76) v1(80.18,24.24) v1(80.32,28.72) v1(80.59,17.71) v1(80.78,30.51) v1(81.28,47.85) v1(81.48,28.72) v1(81.75,17.71) v1(81.94,30.51) v1(82.3,46.93) v1(82.64,28.72) v1(82.91,17.71) v1(83.1,30.51) v1(83.41,45.82) v1(83.88,48.92) v1(83.8,28.72) v1(84.07,17.71) v1(84.26,30.51) v1(84.39,53) v1(84.48,44.65) v1(84.85,50.29) v1(84.8,49.27) v1(84.85,48.2) v1(85.23,17.71) v1(85.6,43.73) v1(86.56,70.94) v1(86.6,72.13) v1(86.62,42.81) v1(87.5,41.78) v1(87.76,72.13) v1(87.72,70.94) v1(88.62,40.86) v1(88.87,70.94) v1(88.92,72.13) v1(89.46,17.76) v1(89.64,39.94) v1(90.08,72.13) v1(90.03,70.94) v1(90.4,38.67) v1(90.62,17.76) v1(90.78,66.92) v1(90.78,65.76) v1(90.78,64.6) v1(90.78,63.44) v1(91.04,20.97) v1(91.24,72.13) v1(91.53,37.75) v1(91.78,17.76) v1(91.8,71.05) v1(92.25,66.66) v1(92.25,65.51) v1(92.25,64.35) v1(92.25,63.19) v1(92.2,20.97) v1(92.39,72.13) v1(92.55,36.83) v1(92.96,71.05) v1(92.93,17.76) v1(93.25,67.02) v1(93.25,65.86) v1(93.25,64.7) v1(93.25,63.54) v1(93.36,20.97) v1(93.55,72.13) v1(94.12,71.05) v1(94.09,17.76) v1(94.52,20.97) v1(94.66,67.38) v1(94.66,66.22) v1(94.66,65.06) v1(94.66,63.9) v1(94.71,72.13) v1(95.28,71.05) v1(95.25,17.76) v1(95.68,26.43) v1(95.67,20.97) v1(95.93,66.41) v1(95.93,65.25) v1(95.93,64.09) v1(95.93,62.93) v1(96.29,72.18) v1(96.37,61.79) v1(96.37,60.64) v1(96.37,59.48) v1(96.37,58.32) v1(96.44,71.05) v1(96.41,17.76) v1(96.55,55.15) v1(96.5,54.45) v1(96.55,53.75) v1(96.7,52.94) v1(96.7,51.78) v1(96.7,50.63) v1(96.7,49.47) v1(96.75,41.77) v1(96.84,26.43) v1(96.83,20.97) v1(97.45,72.18) v1(97.57,17.76) v1(97.6,71.05) v1(97.77,40.67) v1(98.08,56.67) v1(98,26.43) v1(97.99,20.97) v1(98.61,72.18) v1(98.76,71.05) v1(98.89,40.56) v1(99.16,26.43) v1(99.15,20.97) v1(99.25,41.31) v1(99.66,22.5) v1(99.77,72.18) v1(99.91,71.05) v1(99.96,41.77) v1(99.96,40.62) v1(100.12,17.71) v1(100.31,26.43) v1(100.82,22.5) v1(100.93,72.18) v1(101.28,17.71) v1(101.47,26.43) v1(101.98,22.5) v1(102.09,72.18) v1(102.43,17.71) v1(102.63,26.43) v1(103.13,22.5) v1(103.24,72.18) v1(103.59,17.71) v1(103.79,26.43) v1(104.29,22.5) v1(104.4,72.18) v1(104.75,17.71) v1(105.37,59.32) v1(105.37,58.16) v1(105.37,57) v1(105.37,55.84) v1(105.45,22.5) v1(105.78,43) v1(105.91,17.71) v1(106.03,41.83) v1(106.14,40.66) v1(106.19,58.71) v1(106.19,57.55) v1(106.19,56.39) v1(106.19,55.23) v1(106.61,22.5) v1(106.94,43) v1(107,45.86) v1(107.07,17.71) v1(107.19,41.83) v1(107.29,40.66) v1(107.77,22.5) v1(108.16,45.86) v1(108.1,43) v1(108.23,17.71) v1(108.35,41.83) v1(108.45,40.66) v1(108.59,44.28) v1(108.96,62.51) v1(109.25,43) v1(109.32,45.86) v1(109.51,41.83) v1(109.66,44.79) v1(110.11,62.51) v1(110.11,54.57) v1(110.37,61.71) v1(110.37,17.66) v1(110.48,45.86) v1(110.67,41.83) v1(111.27,62.51) v1(111.18,54.84) v1(111.38,44.69) v1(111.53,61.71) v1(111.53,17.66) v1(111.64,45.86) v1(111.83,41.83) v1(112.31,54.74) v1(112.43,62.51) v1(112.69,61.71) v1(112.73,43) v1(112.69,17.66) v1(112.8,45.86) v1(112.97,48.3) v1(112.97,47.14) v1(112.98,41.83) v1(113.09,40.66) v1(113.38,55.95) v1(113.38,54.79) v1(113.85,61.71) v1(113.84,17.66) v1(113.95,45.86) v1(113.89,43) v1(114.09,48.2) v1(114.09,47.04) v1(114.14,41.83) v1(114.25,40.66) v1(114.29,54.37) v1(114.39,44.18) v1(115.06,53.04) v1(115.06,51.89) v1(115.06,50.73) v1(115.06,49.57) v1(114.99,42.85) v1(115,17.66) v1(115.16,48.25) v1(115.16,47.09) v1(115.11,45.86) v1(115.82,61.92) v1(115.82,60.76) v1(115.82,59.6) v1(115.82,58.44) v1(116.03,51.87) v1(116.03,50.71) v1(116.03,49.55) v1(116.03,48.4) v1(116.16,17.66) v1(116.67,45.2) v1(116.95,61.82) v1(116.95,60.66) v1(116.95,59.5) v1(116.95,58.34) v1(116.9,52.74) v1(116.9,51.58) v1(116.9,50.42) v1(116.9,49.26) v1(117.32,17.66) v1(117.76,51.77) v1(117.76,50.61) v1(117.76,49.45) v1(117.76,48.29) v1(118.02,61.87) v1(118.02,60.71) v1(118.02,59.55) v1(118.02,58.39) v1(118.48,17.66) v1(118.73,52.33) v1(118.73,51.17) v1(118.73,50.01) v1(118.73,48.86) v1(118.94,57.63) v1(118.94,56.48) v1(118.94,55.32) v1(118.94,54.16)
VIN24V: length 27.6
  Top Layer w1.5: USB3.1 101.97,69.22 102.56,68.63 97.9,63.97 D1.1
CPT_RST: length 27.8
  Top Layer w0.3: R5.2 34.01,38.21 33.25,37.46 FPC1.6 33.25,32.63 27.94,27.32 22.58,27.32 20.08,24.82 17.02,24.82 16.5,25.35 FPC2.4
D1+: length 9.2
  Top Layer w0.3: USB1.3 18.79,59.07 18.79,57.45 21.81,54.43 21.81,53.49 22.21,53.09 22.96,53.09
D1-: length 7.3
  Top Layer w0.3: 22.96,54.99 21.89,54.99 19.24,57.64 19.24,59.07 USB1.2
DISP: length 52.6
  Top Layer w0.3: 44.54,26.24 44.59,26.24 47.79,23.04 80.93,23.04 87.25,29.35 FPC3.31
DTR: length 5.8
  Top Layer w0.3: 19.25,35.45 21.61,35.45 21.84,35.68 R22.2 22.68,35.65 Q2.2
ESP_RST: length 25.3
  Top Layer w0.3: C17.2 v1(28.3,61.29) R13.2 29.08,62.22 30.52,63.66 U5.3 ; Q3.3 v1(23.91,44.64)
  Bottom Layer w0.3: v1(28.3,61.29) 27.63,60.62 27.63,48.36 v1(23.91,44.64)
IO0_G3: length 70.8
  Top Layer w0.3: FPC3.16 79.75,37.58 73.33,44 54.2,44 v1(54.1,43.89) ; Q2.3 v1(28.14,36.6) ; v1(51.96,48.64) R14.2 51.88,49.69 U5.27
  Bottom Layer w0.3: v1(51.96,48.64) 54.1,46.5 v1(54.1,43.89) 42.32,43.89 34.57,36.14 29.57,36.14 29.11,36.6 v1(28.14,36.6)
IO1_R3: length 42.5
  Top Layer w0.3: FPC3.8 75.75,37.5 72.82,40.43 71.44,40.43 v1(68.89,42.98) ; U5.39 50.76,64.93 51.96,63.73 51.96,59.91 v1(59.87,52)
  Bottom Layer w0.3: v1(59.87,52) v1(68.89,42.98)
IO2_R4: length 42.4
  Top Layer w0.3: v1(61.55,51.39) 59.51,51.39 51.4,59.5 51.4,62.76 50.5,63.66 U5.38 ; v1(69.96,42.82) 71.67,41.12 72.91,41.12 76.25,37.78 FPC3.9
  Bottom Layer w0.3: v1(61.55,51.39) 61.97,50.97 61.97,50.96 62.29,50.64 62.3,50.64 69.96,42.98 v1(69.96,42.82)
IO3_VSY: length 65.3
  Top Layer w0.3: v1(39.67,50.93) 34.36,50.93 33.35,49.91 U5.15 ; FPC3.33 88.25,38.72 77.96,49 54.76,49 v1(54.05,49.71)
  Bottom Layer w0.3: v1(39.67,50.93) 52.83,50.93 v1(54.05,49.71)
IO4_INT: length 51.5
  Top Layer w0.3: v1(31.8,33.24) 31.75,33.29 FPC1.3 31.75,37.15 32.12,37.52 32.12,46.75 v1(29.67,49.2) ; v1(18.2,29.05) 17.59,29.05 15.5,26.97 FPC2.5 ; v1(30.13,62.25) 30.27,62.39 U5.4
  Bottom Layer w0.3: v1(30.13,62.25) 29.83,61.95 29.83,49.36 v1(29.67,49.2) ; v1(31.8,33.24) 27.62,29.05 v1(18.2,29.05)
IO5_DE: length 71.2
  Top Layer w0.3: v1(36,58.84) 33.71,61.12 U5.5 ; v1(69.4,49.76) 69.71,49.45 78.43,49.45 88.75,39.13 FPC3.34
  Bottom Layer w0.3: v1(36,58.84) 40.79,54.04 67.01,54.04 69.4,51.65 v1(69.4,49.76)
IO7_PCLK: length 39.8
  Top Layer w0.3: L3.2 69.15,53.32 v1(66.75,53.32) ; U5.7 33.55,58.58 v1(33.96,58.17)
  Bottom Layer w0.3: v1(33.96,58.17) 38.6,53.53 66.53,53.53 v1(66.75,53.32)
IO8_SDA: length 40.8
  Top Layer w0.3: R7.2 31,38.96 v1(31,38.13) 31.25,37.88 FPC1.2 31.25,31.75 27.89,28.39 19.63,28.39 18.5,27.26 FPC2.2 ; v1(29.11,52) 29.34,52.23 U5.12
  Bottom Layer w0.3: v1(31,38.13) 28.55,40.58 28.55,51.44 v1(29.11,52)
IO9_SCL: length 39.1
  Top Layer w0.3: U5.17 35.89,38.48 v1(35.28,37.88) ; FPC1.1 30.75,36.85 v1(30.69,36.91) 29.91,37.69 29.91,38.27 29.11,39.07 R6.2 29.06,36.55 21.46,28.95 19.42,28.95 17.5,27.03 FPC2.3
  Bottom Layer w0.3: v1(30.69,36.91) 34.31,36.91 v1(35.28,37.88)
IO10_B7: length 57.1
  Top Layer w0.3: v1(37.68,46.85) 37.17,47.36 37.16,47.36 U5.18 ; v1(49.61,47.97) 75.65,47.97 85.75,37.87 FPC3.28
  Bottom Layer w0.3: v1(37.68,46.85) 38.8,47.97 v1(49.61,47.97)
IO14_B3: length 48.2
  Top Layer w0.3: U5.22 42.24,47.36 45.3,44.3 51.86,44.3 53.39,42.77 67.72,42.77 71.03,39.46 v1(72.72,39.46) ; v1(82.51,37.62) 83.75,36.38 FPC3.24
  Bottom Layer w0.3: v1(82.51,37.62) 80.67,39.46 v1(72.72,39.46)
IO17_B6: length 63.5
  Top Layer w0.3: v1(50.79,47.26) 75.72,47.26 85.25,37.74 FPC3.27 ; v1(33.8,54.35) 33.38,54.77 U5.10
  Bottom Layer w0.3: v1(50.79,47.26) 50.79,47.82 50.02,48.59 39.57,48.59 v1(33.8,54.35)
IO18_B5: length 61.9
  Top Layer w0.3: FPC3.26 84.75,37.41 75.64,46.52 v1(75.55,46.52) ; v1(35.54,53.48) 32.65,53.48 32.63,53.5 U5.11
  Bottom Layer w0.3: v1(35.54,53.48) 35.94,53.08 64.91,53.08 70.58,47.41 74.66,47.41 v1(75.55,46.52)
IO21_G7: length 46.2
  Top Layer w0.3: FPC3.20 81.75,38.18 73.74,46.19 44.26,46.19 43.51,46.94 U5.23
IO38_B4: length 44.2
  Top Layer w0.3: FPC3.25 84.25,36.85 74.6,46.5 v1(74.5,46.5) ; v1(50.68,54.81) 50.65,54.77 U5.31 ; v1(61.91,52.36) 59.76,54.5 v1(59.76,54.66)
  Bottom Layer w0.3: v1(74.5,46.5) 74.04,46.95 70.07,46.95 64.66,52.36 v1(61.91,52.36) ; v1(59.76,54.66) 50.84,54.66 v1(50.68,54.81)
IO39_G2: length 45
  Top Layer w0.3: v1(55.2,43.36) 55.38,43.54 73.15,43.54 79.25,37.44 FPC3.15 ; v1(53.54,52.46) 53.54,53.28 50.78,56.04 U5.32
  Bottom Layer w0.3: v1(53.54,52.46) 55.2,50.8 v1(55.2,43.36)
IO40_R7: length 39.6
  Top Layer w0.3: FPC3.12 77.75,38.2 73.07,42.87 v1(72.87,42.87) ; U5.33 50.99,57.31 58.69,49.61 65.73,49.61 v1(65.93,49.81)
  Bottom Layer w0.3: v1(72.87,42.87) v1(65.93,49.81)
IO41_R6: length 39.5
  Top Layer w0.3: FPC3.11 77.25,38.06 73.14,42.17 72.55,42.17 v1(71.85,42.87) ; U5.34 50.79,58.58 59.2,50.17 v1(64.76,50.17)
  Bottom Layer w0.3: v1(64.76,50.17) 71.85,43.08 v1(71.85,42.87)
IO42_R5: length 39.6
  Top Layer w0.3: v1(71.03,42.67) 72.13,41.57 73.1,41.57 76.75,37.92 FPC3.10 ; U5.35 50.33,59.85 59.41,50.78 62.67,50.78 v1(62.87,50.98)
  Bottom Layer w0.3: v1(62.87,50.98) 71.03,42.82 v1(71.03,42.67)
IO45_G4: length 40.5
  Top Layer w0.3: v1(47.32,47.16) 47.32,47.16 U5.26 ; FPC3.17 80.25,37.74 73.48,44.51 v1(52.88,44.51)
  Bottom Layer w0.3: v1(47.32,47.16) 49.97,44.51 v1(52.88,44.51)
IO46_HSY: length 63.8
  Top Layer w0.3: v1(53.34,49.05) 53.9,48.48 77.21,48.48 87.75,37.94 FPC3.32 ; v1(39.01,50.32) 35.38,50.32 34.62,49.55 U5.16 34.62,47.06 v1(34.67,47.01)
  Bottom Layer w0.3: v1(53.34,49.05) 52.06,50.32 v1(39.01,50.32)
IO47_G6: length 44.7
  Top Layer w0.3: U5.24 44.77,48.4 v1(44.77,47.16) ; FPC3.19 81.25,38.02 73.58,45.68 45.89,45.68 v1(45.76,45.55)
  Bottom Layer w0.3: v1(44.77,47.16) 44.77,46.55 v1(45.76,45.55)
IO48_G5: length 42.5
  Top Layer w0.3: FPC3.18 80.75,37.88 73.46,45.17 48.14,45.17 v1(48.03,45.07) ; v1(46.3,46.8) 46.05,47.05 U5.25
  Bottom Layer w0.3: v1(46.3,46.8) v1(48.03,45.07)
LCD_RST/NC: length 58.1
  Top Layer w0.3: R16.2 42.45,25.26 45.38,22.32 82.36,22.32 89.25,29.21 FPC3.35
PCLK: length 26.1
  Top Layer w0.3: L3.1 70.86,51.97 C19.2 70.89,51.95 v1(72,51.95) ; FPC3.30 86.75,38.13 v1(76.98,47.9)
  Bottom Layer w0.3: v1(72,51.95) 72.92,51.95 v1(76.98,47.9)
PWM: length 24.9
  Top Layer w0.3: U5.6 32.99,59.85 v1(33.09,59.76) ; R9.1 40.98,42.12 v1(39.97,43.13)
  Bottom Layer w0.3: v1(39.97,43.13) 36.35,46.75 36.35,50.68 33.09,53.94 v1(33.09,59.76)
R: length 20
  Top Layer w0.3: U6.3 15.72,36.72 16.31,37.32 16.31,40.36 15.38,41.29 R19.2 15.38,41.39 17.57,43.59 20.14,43.59 22.43,45.88 24.55,45.88 D8.2
R1IN: length 70.3
  Top Layer w0.4: U7.13 v1(85.82,56.06)
  Bottom Layer w0.4: USB4.2 74.79,64.72 78.89,60.62 78.89,58.79 81.62,56.06 v1(85.82,56.06) 85.82,45.53 94.55,36.81 100.31,36.81 112.2,24.91 P2.2
R1OUT: length 9.2
  Top Layer w0.3: U7.12 86.05,57.33 85.2,56.48 85.2,52.6 83.53,50.93 R23.1
R2IN: length 56.9
  Top Layer w0.4: U7.8 91.33,61.14 v1(90.52,61.95) 85.74,66.72 83.96,66.72
  Bottom Layer w0.4: v1(90.52,61.95) 90.52,44.66 96.6,38.58 116.58,38.58
R2OUT: length 7.2
  Top Layer w0.3: R26.1 83,56.83 83.84,57.66 83.84,59.5 85.47,61.14 U7.9
RTS: length 8.7
  Top Layer w0.3: 19.25,36.72 20.61,36.72 21.36,37.47 21.36,38.5 22.68,39.83 R20.2 23.94,41.11 Q3.2
RXD0: length 74.3
  Top Layer w0.3: v1(33.91,51.39) 38.14,51.39 47.87,61.12 U5.36 50.39,61.12 v1(50.53,60.98) ; R18.1 28.81,47.67 30.49,45.99 v1(30.49,43.64) 29.62,42.77 D9.2 ; R23.2 79.44,50.93 74.95,55.42 71.9,55.42 v1(69.3,58.02)
  Bottom Layer w0.3: v1(69.3,58.02) 53.49,58.02 v1(50.53,60.98) ; v1(33.91,51.39) 33.91,51.19 31.36,48.64 31.36,44.51 v1(30.49,43.64)
RXD1: length 50.1
  Top Layer w0.3: v1(39.01,57.26) 31.63,57.26 U5.8 ; R26.2 81.35,56.8 v1(76.75,56.8)
  Bottom Layer w0.3: v1(39.01,57.26) 76.28,57.26 v1(76.75,56.8)
SD_CD: length 2.7
  Top Layer w0.3: U8.9 67.43,58.85 R30.1
SD_CS: length 3.2
  Top Layer w0.3: R27.1 59.73,60.02 U8.2
SD_MISO: length 33.2
  Top Layer w0.3: v1(46.61,54.76) 40.97,49.12 U5.21 ; U8.7 65.24,59.2 R29.1 65.07,58.84 64.05,57.82 v1(64.05,56.08)
  Bottom Layer w0.3: v1(64.05,56.08) 63.38,55.42 47.27,55.42 v1(46.61,54.76)
SD_MOSI: length 32.2
  Top Layer w0.3: v1(60.07,56.03) 60.07,57.61 61.24,58.79 R28.1 60.84,59.72 U8.3 ; U5.19 38.43,49.38 38.7,49.66 39.57,49.66 v1(45.13,55.22)
  Bottom Layer w0.3: v1(60.07,56.03) 49.21,56.03 49.1,55.93 45.84,55.93 v1(45.13,55.22)
SD_SCLK: length 33.2
  Top Layer w0.3: v1(47.52,59.5) 47.52,56.75 39.7,48.92 U5.20 ; v1(62.77,63.12) 63.04,62.86 U8.5
  Bottom Layer w0.3: v1(47.52,59.5) 47.52,60.11 50.53,63.12 v1(62.77,63.12)
SL_D+: length 10.2
  Top Layer w0.3: U6.5 12.49,34.18 10.67,32.36 USB2.6 6.77,32.36 6.42,32.01 6.42,31.6 6.66,31.36 USB2.8
SL_D-: length 9.3
  Top Layer w0.3: USB2.7 10.81,31.86 11.86,32.91 U6.6 ; USB2.5 9.1,32.86 v1(9.32,33.08)
  Bottom Layer w0.3: v1(9.32,33.08) v1(9.32,31.76)
T: length 14.2
  Top Layer w0.3: U6.2 15.41,37.99 v1(15.44,38.03) ; D9.1 25.7,42.26 v1(25.34,41.91)
  Bottom Layer w0.3: v1(25.34,41.91) 21.11,41.91 17.23,38.03 v1(15.44,38.03)
T1IN: length 8.6
  Top Layer w0.3: U7.11 85.33,58.6 84.75,58.01 84.75,54.66 83,52.92 83,52.87
T1OUT: length 69.7
  Top Layer w0.4: v1(88.83,54.86) 88.76,54.79 U7.14
  Bottom Layer w0.4: 71.72,66.72 74.93,66.72 80.67,60.98 83.17,60.98 88.83,55.32 v1(88.83,54.86) 88.83,43.95 95.31,37.47 102.5,37.47 112.52,27.45 P2.3
T2IN: length 8
  Top Layer w0.3: U7.10 85.22,59.87 84.29,58.94 84.29,56.15 83,54.86 R25.1
T2OUT: length 54.3
  Top Layer w0.4: U7.7 91.47,59.87 86.62,64.72 USB3.3
  Bottom Layer w0.4: 116.58,41.12 114.71,39.25 96.94,39.25 91.23,44.97 v1(91.23,60.06)
TXD0: length 65.7
  Top Layer w0.3: v1(70.78,58.07) 72.82,56.03 75.31,56.03 78.42,52.92 81.25,52.92 ; D8.1 28.25,44.67 v1(29.21,45.63) ; v1(50.74,62.15) 50.5,62.39 U5.37 48.02,62.39 37.83,52.21 v1(33.55,52.21)
  Bottom Layer w0.3: v1(33.55,52.21) 33.55,52.12 30.13,48.7 30.13,46.55 v1(29.21,45.63) ; 70.81,58.07 v1(70.78,58.07) 70.22,58.63 54.26,58.63 v1(50.74,62.15)
TXD1: length 50.8
  Top Layer w0.3: v1(76.08,56.29) 77.56,54.81 R25.2 ; U5.9 39.42,56.04 v1(39.67,56.29)
  Bottom Layer w0.3: v1(76.08,56.29) 64.62,56.29 64.28,56.64 40.02,56.64 v1(39.67,56.29)
USB_D+: length 7.5
  Top Layer w0.3: U5.14 30.53,49.69 30.12,50.1 29.43,50.1 26.41,53.13 25.55,53.13 25.54,53.13
USB_D-: length 8.8
  Top Layer w0.3: U5.13 30.53,50.96 30.12,50.55 29.62,50.55 26.2,53.97 26.2,54.69 25.91,54.99 D7.6
VLED+: length 21.5
  Top Layer w0.3: FPC3.2 72.75,36.21 72.11,36.85 C9.2
  Top Layer w0.5: v1(62.21,29.87) 62.21,29.2 D6.2 ; U3.5 59.97,33.44 60.32,33.08 v1(62.21,33.08) 63.89,33.08 64.66,33.85 C10.1 67.17,34.36 C9.2
  Bottom Layer w0.5: v1(62.21,29.87) v1(62.21,33.08)
VLED-: length 17.2
  Top Layer w0.3: U3.3 60.92,30.91 61.14,30.69 63.73,30.69 R11.1 64.1,30.41 R10.1 66.12,30.23 71.49,30.23 72.25,30.98 FPC3.1
$9N274640: length 11.6
  Top Layer w0.8: 101.55,55.56 102.36,55.56 105.84,52.08 U1.2 ; 101.55,55.56 L1.2 ; 101.55,55.56 102.1,56.12 D2.2
$9N274642: length 3.7
  Top Layer w0.4: R3.1 108.88,47.41 108.06,48.23 U1.4
$9N274647: length 2.4
  Top Layer w0.4: D3.1 117.77,54.84 R1.1
$9N274649: length 1.9
  Top Layer w0.4: R2.1 95.2,47.11 D5.1
$9N275850: length 5.5
  Top Layer w0.3: 13.78,35.45 11.34,35.45 10.8,35.99 C21.1
$9N275879: length 2.6
  Top Layer w0.3: Q2.1 24.27,38.23 R20.1
$9N275880: length 5.7
  Top Layer w0.3: v1(22.02,41.14) 22.04,41.16 Q3.1 ; v1(22.74,38.44) 22.74,37.35 R22.1
  Bottom Layer w0.3: v1(22.02,41.14) 22.02,39.15 v1(22.74,38.44)
$9N276006: length 2.2
  Top Layer w0.4: R21.2 3.58,40.18 D10.1
$9N276822: length 2.9
  Top Layer w0.4: C26.1 94.4,58.6 U7.6
$9N276825: length 4.8
  Top Layer w0.4: U7.2 91.73,53.52 91.02,52.81 C22.2
$9N276826: length 2.4
  Top Layer w0.4: U7.4 95.1,56.06 C25.2
$9N276827: length 2.5
  Top Layer w0.4: U7.5 94.89,57.33 C25.1
$9N276828: length 2.5
  Top Layer w0.4: U7.1 94.68,52.25 C23.2
$9N276829: length 2.6
  Top Layer w0.4: U7.3 94.4,54.79 C23.1
$9N279321: length 2.1
  Top Layer w0.8: 51.2,25.79 53.25,25.79 53.3,25.84
$9N279477: length 13
  Top Layer w0.5: D6.1 59.02,30.2 U3.1
  Top Layer w0.8: 57.12,28.31 D6.1 ; 57.12,28.31 L2.2 ; 57.12,28.31 54.9,26.09 R8.1
$9N279526: length 7.2
  Top Layer w0.3: U3.4 60.92,36.77 59.92,37.76 R4.2 59.92,38.6 59.9,38.62 Q1.3
$9N279598: length 15
  Top Layer w0.3: v1(55.99,41.85) 57.86,41.85 Q1.1 ; R12.1 45.03,40.11 R9.2 v1(46.81,42.12)
  Bottom Layer w0.3: v1(55.99,41.85) 55.72,42.12 v1(46.81,42.12)

## Copper pours and planes (outline as drawn; the poured copper is in the pictures)
GND on Top Layer: -3.18,76.28 121.57,76.28 121.57,-2.06 -3.18,-2.06
GND on Bottom Layer: -2.77,76.74 123.1,76.74 123.1,-2.06 -2.77,-2.06

Small or netless copper shapes (teardrops, artwork), in the pictures only: 388 on Top Layer, 119 on Bottom Layer

## Text on the board
Top Silkscreen Layer: GND | IN2 | OUT2 | 24V+ | IN1 | 5V+
